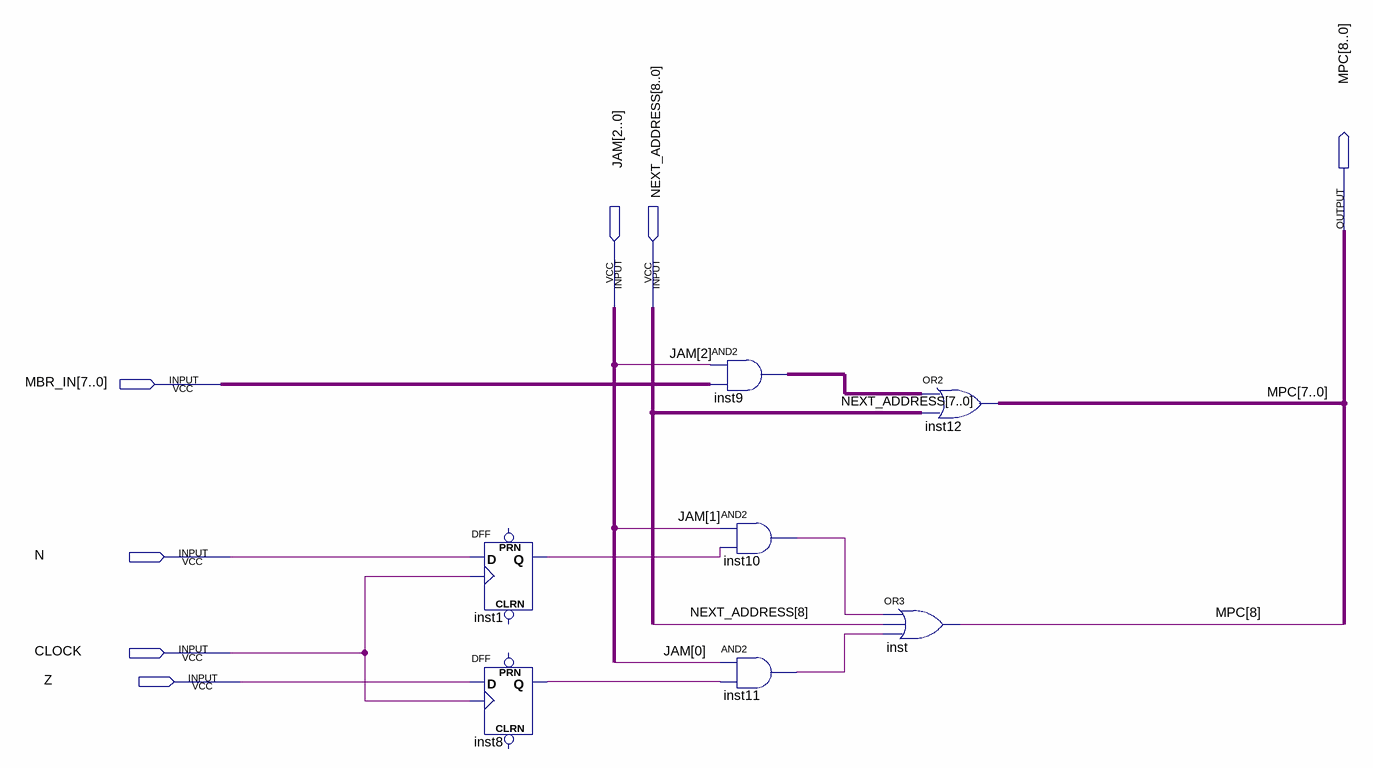
[diagram p0: schematic sheet]
// Quartus schematic MPC_generator.bdf as structural Verilog: 7 symbols, 7 pins
module MPC_generator (
  input  [2:0] JAM,
  input  [8:0] NEXT_ADDRESS,
  input  [7:0] MBR_IN,
  input  N,
  input  CLOCK,
  input  Z,
  output [8:0] MPC
);

  wire inst1_q, inst8_q, inst10_out, inst11_out;
  wire [7:0] inst9_out;

  DFF inst1 (.CLK(CLOCK), .D(N), .Q(inst1_q));  // open: CLRN, PRN
  DFF inst8 (.CLK(CLOCK), .D(Z), .Q(inst8_q));  // open: CLRN, PRN
  assign inst9_out = {8{JAM[2]}} & MBR_IN;  // AND2 inst9, 8 bits wide
  and inst10 (inst10_out, JAM[1], inst1_q);
  and inst11 (inst11_out, JAM[0], inst8_q);
  assign MPC[7:0] = inst9_out | NEXT_ADDRESS[7:0];  // OR2 inst12, 8 bits wide
  or inst (MPC[8], inst10_out, NEXT_ADDRESS[8], inst11_out);
endmodule
